# EAGLE schematic task1_analog (EAGLE 9.6.2)
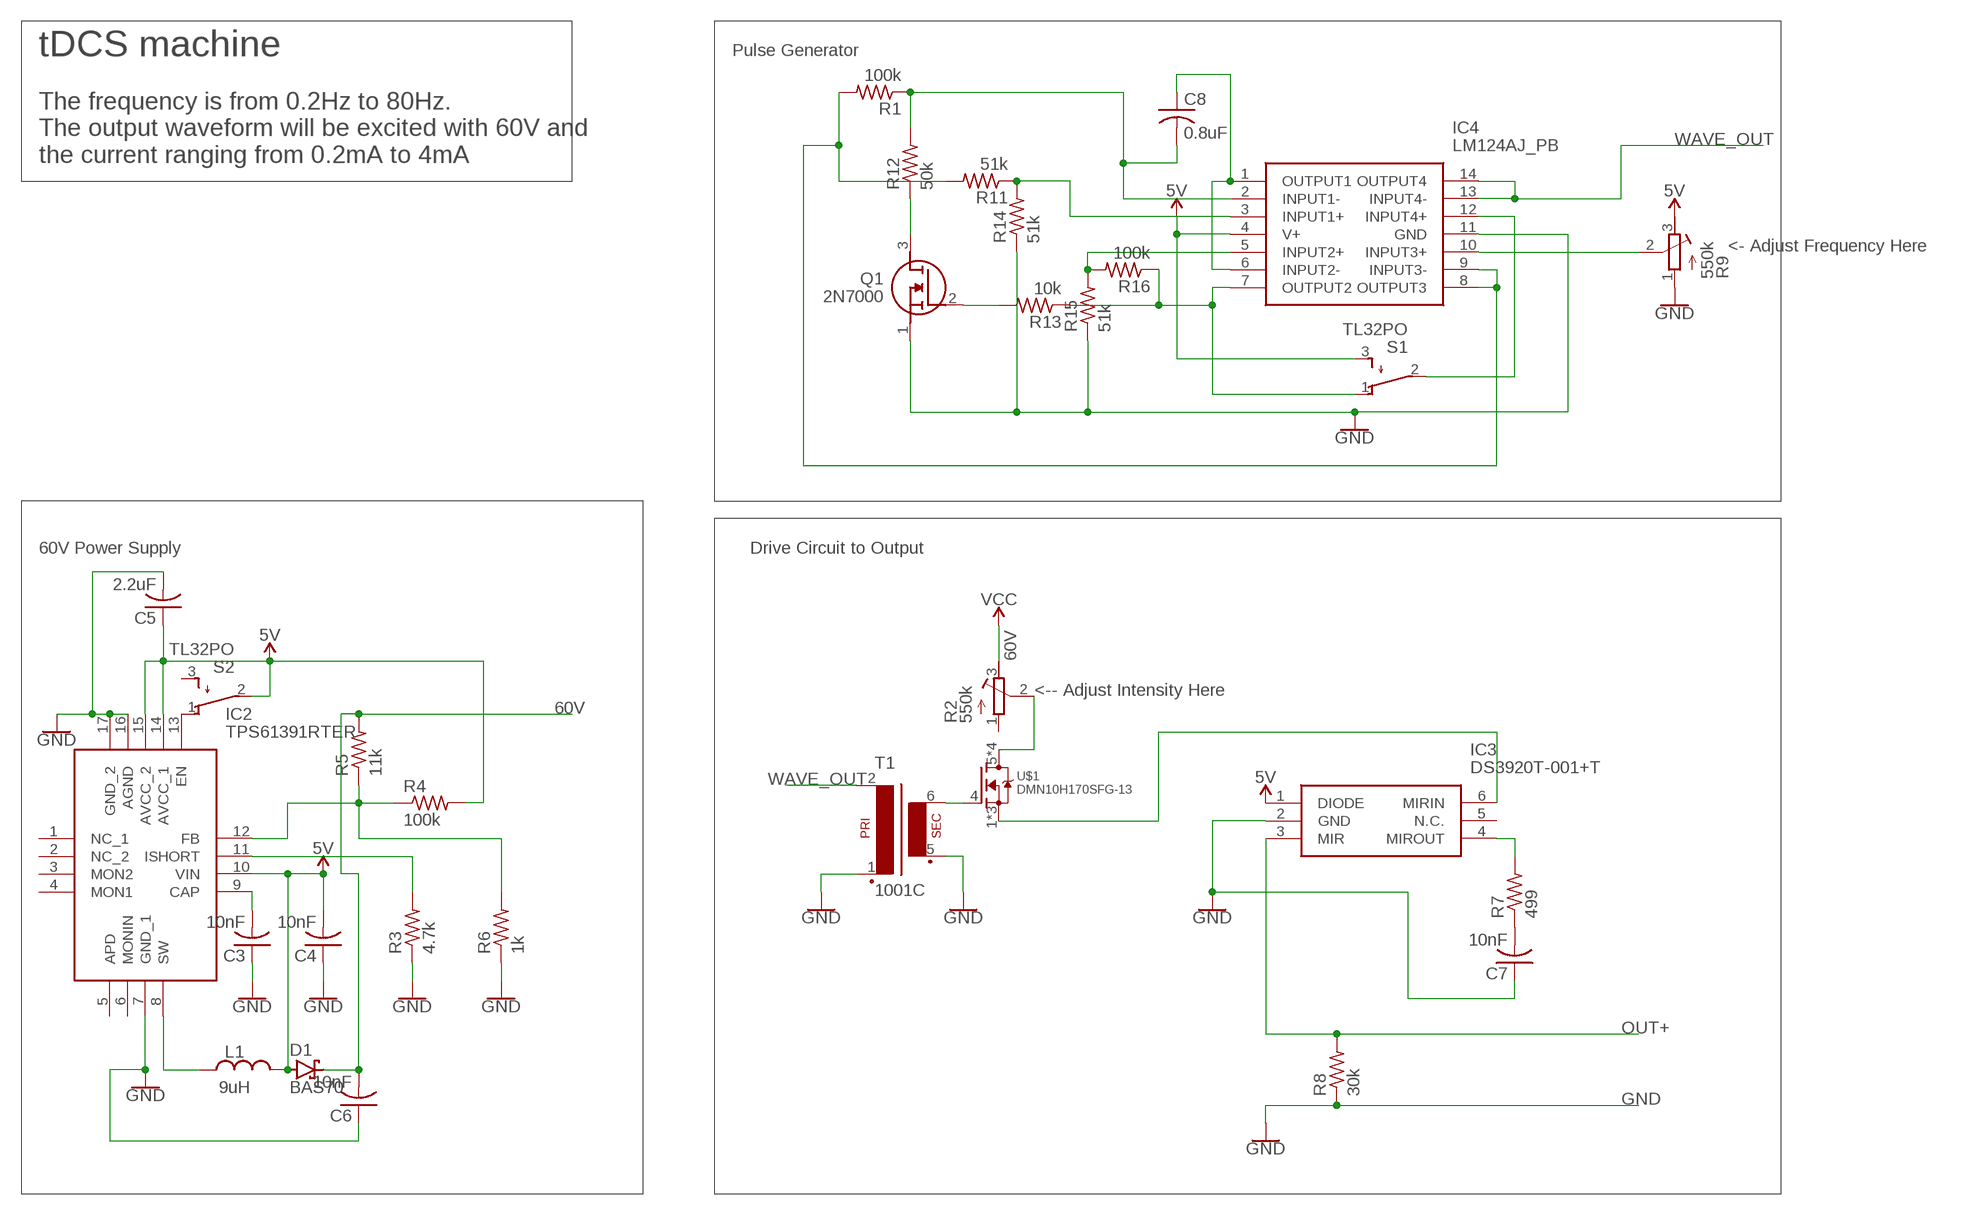
[diagram p0: schematic, sheet 1]

## Parts
C3  10nF  C-USC0805  [C0805]
C4  10nF  C-USC0805  [C0805]
C5  2.2uF  C-USC0805  [C0805]
C6  10nF  C-USC0805  [C0805]
C7  10nF  C-USC0805  [C0805]
C8  0.8uF  C-USC0805  [C0805]
D1  BAS70  [SOT23]
IC2  TPS61391RTER  [QFN50P300X300X80-17N]
IC3  DS3920T-001+T  [SOT95P280X145-6N]
IC4  LM124AJ_PB  [DIP790W66P254L1954H508Q14N]
L1  9uH  L_CHIP-1206(3216-METRIC)  [INDC3216X190]
Q1  2N7000  [TO-92_(TO-226)]
R1  100k  R-US_R0805  [R0805]
R2  550k  R-TRIMM4G/J  [RTRIM4G/J]
R3  4.7k  R-US_R0805  [R0805]
R4  100k  R-US_R0805  [R0805]
R5  11k  R-US_R0805  [R0805]
R6  1k  R-US_R0805  [R0805]
R7  499  R-US_R0805  [R0805]
R8  30k  R-US_R0805  [R0805]
R9  550k  R-TRIMM4G/J  [RTRIM4G/J]
R11  51k  R-US_R0805  [R0805]
R12  50k  R-US_R0805  [R0805]
R13  10k  R-US_R0805  [R0805]
R14  51k  R-US_R0805  [R0805]
R15  51k  R-US_R0805  [R0805]
R16  100k  R-US_R0805  [R0805]
S1  TL32PO  [TL3XPO]
S2  TL32PO  [TL3XPO]
T1  1001C  [1001]
U$1  DMN10H170SFG-13  [TRANS_DMP3017SFGQ-7]

## Nets
5V: C4.2 C5.1 D1.1(A) IC2.10(VIN) IC2.14(AVCC_1) IC2.15(AVCC_2) IC3.1(DIODE) IC4.4(V+) L1.2 R4.2 R9.3(E) S1.3(S) S2.2(P)
60V: C6.2 D1.3(C) R2.3(E) R5.2 ; supply symbol labelled VCC
GND: C3.1 C4.1 C5.2 C6.1 C7.1 IC2.7(GND_1) IC2.16(AGND) IC2.17(GND_2) IC3.2(GND) IC4.11(GND) Q1.1(S) R3.1 R6.1 R8.1 R9.1(A) R14.1 R15.1 T1.1 T1.5(S1)
N$2: IC4.10(INPUT3+) R9.2(S)
N$3: IC4.12(INPUT4+) S1.2(P)
N$4: IC4.7(OUTPUT2) R13.1 R16.1 S1.1(O)
N$5: T1.6(S2) U$1.4(G)
N$6: R2.2(S) U$1.5(D) U$1.6(D) U$1.7(D) U$1.8(D)
N$7: IC2.13(EN) S2.1(O)
N$8: C3.2 IC2.9(CAP)
N$9: IC2.11(ISHORT) R3.2
N$10: IC2.8(SW) L1.1
N$11: IC2.12(FB) R4.1 R5.1 R6.2
N$12: IC3.4(MIROUT) R7.2
N$13: IC3.6(MIRIN) U$1.1(S) U$1.2(S) U$1.3(S)
N$14: C7.2 R7.1
N$15: C8.1 IC4.1(OUTPUT1) IC4.6(INPUT2-)
N$16: IC4.3(INPUT1+) R11.1 R14.2
N$17: IC4.5(INPUT2+) R15.2 R16.2
N$18: C8.2 IC4.2(INPUT1-) R1.1 R12.2
N$19: Q1.3(D) R12.1
N$21: Q1.2(G) R13.2
N$22: IC4.8(OUTPUT3) IC4.9(INPUT3-) R1.2 R11.2
OUT+: IC3.3(MIR) R8.2
WAVE_OUT: IC4.13(INPUT4-) IC4.14(OUTPUT4) T1.2
Unconnected: IC2.1(NC_1) IC2.2(NC_2) IC2.3(MON2) IC2.4(MON1) IC2.5(APD) IC2.6(MONIN) IC3.5(N.C.) R2.1(A) S2.3(S)

## Notes on the sheet
- tDCS machine | Pulse Generator
- The frequency is from 0.2Hz to 80Hz.
  The output waveform will be excited with 60V and
  the current ranging from 0.2mA to 4mA
- <- Adjust Frequency Here
- 60V Power Supply | Drive Circuit to Output
- <-- Adjust Intensity Here

## Library data of the parts
C3-C8 = adafruit:C-US: CAPACITOR, American symbol
D1 = diode:BAS70: Silicon Schottky Diodes General-purpose diode for high-speed switching
IC2 = TPS61391RTER:TPS61391RTER: Switching Voltage Regulators 85-VOUT boost converter 16-WQFN -40 to 125 Source: Datasheet <https://www.ti.com/general/docs/suppproductinfo.tsp?distId=10&gotoUrl=http://www.ti.com/lit/gpn/tps61391>; ARROW_PART_NUMBER: TPS61391RTER; ARROW_PRICE-STOCK: https://www.arrow.com/en/products/tps61391rter/texas-instruments?region=nac; DESCRIPTION: Switching Voltage Regulators 85-VOUT boost converter 16-WQFN -40 to 125; HEIGHT: 0.8mm; MANUFACTURER_NAME: Texas Instruments; MANUFACTURER_PART_NUMBER: TPS61391RTER; MOUSER_PART_NUMBER: 595-TPS61391RTER; MOUSER_PRICE-STOCK: https://www.mouser.co.uk/ProductDetail/Texas-Instruments/TPS61391RTER?qs=wnTfsH77Xs7Q4UMmH2F4rA%3D%3D
IC3 = SamacSys_Parts:DS3920T-001+T: Current & Power Monitors & Regulators Fast Current Mirror Source: Datasheet <https://componentsearchengine.com/Datasheets/1/DS3920T-001 T.pdf>; DESCRIPTION: Current & Power Monitors & Regulators Fast Current Mirror; HEIGHT: 1.45mm; MANUFACTURER_NAME: Maxim Integrated; MANUFACTURER_PART_NUMBER: DS3920T-001+T; MOUSER_PART_NUMBER: 700-DS3920T-001+T; MOUSER_PRICE-STOCK: https://www.mouser.com/Search/Refine.aspx?Keyword=700-DS3920T-001%2BT
IC4 = SamacSys_Parts:LM124AJ_PB: Low Power Quad Operational Amplifier Source: Datasheet <https://www.ti.com/lit/ds/symlink/lm124-n.pdf?ts=1618899874809&ref_url=https%3A%2F%2Fwww.ti.com%2Fstore%2Fti%2Fen%2Fp%2Fproduct%2F%3Fp%3DLM124AJ%2FPB>; DESCRIPTION: Low Power Quad Operational Amplifier; HEIGHT: 5.08mm; MANUFACTURER_NAME: Texas Instruments; MANUFACTURER_PART_NUMBER: LM124AJ/PB; MOUSER_PART_NUMBER: 926-LM124AJ; MOUSER_PRICE-STOCK: https://www.mouser.co.uk/ProductDetail/Texas-Instruments/LM124AJ-PB?qs=iiglMaU8SAfbl3sWmWrv7A%3D%3D
L1 = Inductor:L: Inductor Fixed - Generic; CATEGORY: Inductor; SUB-CATEGORY: Fixed
Q1 = SamacSys_Parts:2N7000: N-channel MOSFET,2N7000 0.2A 60V Source: Datasheet <http://www.onsemi.com/pub/Collateral/NDS7002A-D.PDF>; DESCRIPTION: N-channel MOSFET,2N7000 0.2A 60V; HEIGHT: mm; MANUFACTURER_NAME: ON Semiconductor; MANUFACTURER_PART_NUMBER: 2N7000; MOUSER_PART_NUMBER: 512-2N7000; MOUSER_PRICE-STOCK: https://www.mouser.co.uk/ProductDetail/ON-Semiconductor-Fairchild/2N7000?qs=FOlmdCx%252BAA2o%2FKZOTk%2F3hg%3D%3D
R1 R3-R8 R11-R16 = adafruit:R-US_: RESISTOR, American symbol
R2 R9 = rcl:R-TRIMM: Trimm resistor; SPICEMODEL: X; SPICEPREFIXL: POT
S1 S2 = switch:TL32PO: TINY SWITCH ON - MOM Source: http://www2.produktinfo.conrad.com/datenblaetter/700000-724999/705152-da-01-de-Subminiaturschalter_TL_36YO.pdf
T1 = 1001C:1001C: Check prices <https://pricing.snapeda.com/parts/1001C/Murata%20Power/view-part?ref=eda>; AVAILABILITY: In Stock; DESCRIPTION: 3mH Pulse Transformer 1:1 Through Hole; MF: Murata Power; MP: 1001C; PACKAGE: UDFN-10 Murata; PRICE: None; PURCHASE-URL: https://pricing.snapeda.com/search/part/1001C/?ref=eda
U$1 = TRANS_DMP3017SFGQ-7:DMN10H170SFG-13